# EAGLE schematic PIR Shield (EAGLE 6.4)
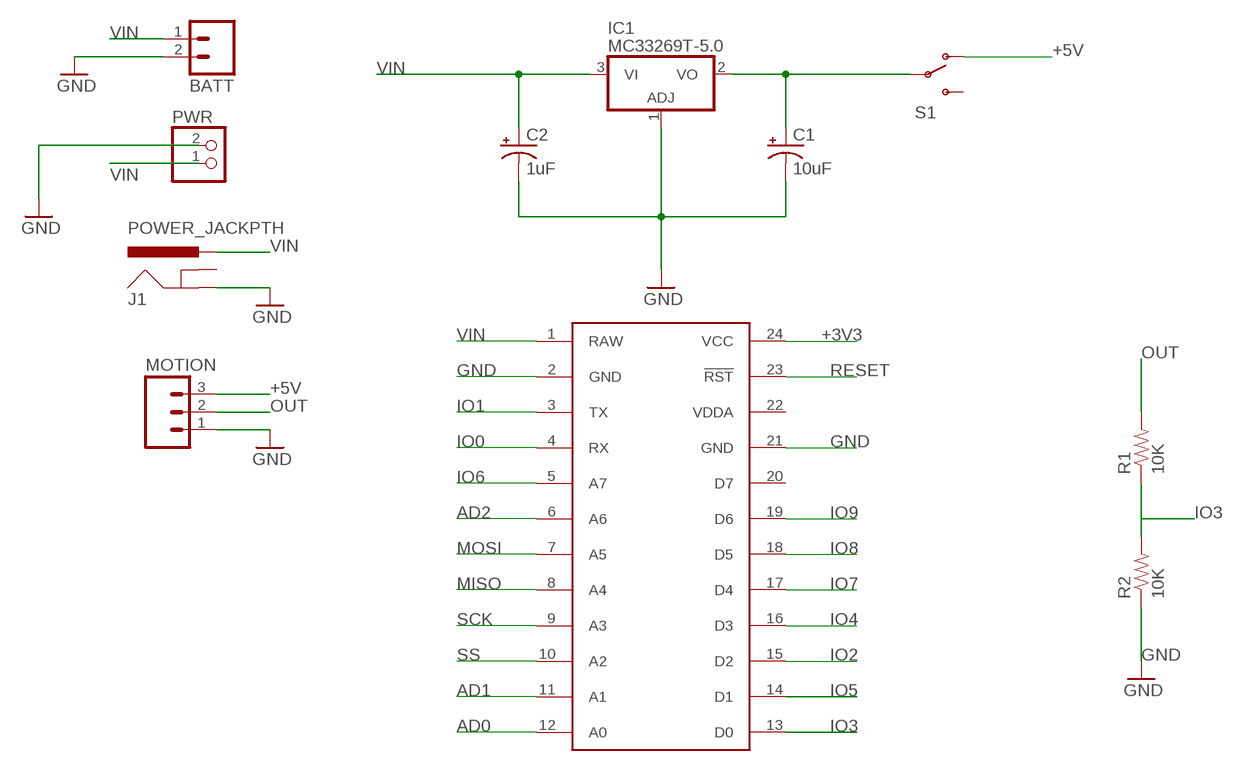
[diagram p0: schematic, sheet 1]

## Parts
BATT  M02LOCK  [1X02_LOCK]
C1  10uF  CAP_POLPTH2  [CPOL-RADIAL-10UF-25V]
C2  1uF  CAP_POLPTH2  [CPOL-RADIAL-10UF-25V]
IC1  MC33269T-5.0  [TO220V]
J1  POWER_JACKPTH  [POWER_JACK_PTH]
MOTION  M03PTH  [1X03]
PWR  JST_2PIN-THM  [JST-PH-2-THM]
R1  10K  RESISTOREZ  [AXIAL-0.3EZ]
R2  10K  RESISTOREZ  [AXIAL-0.3EZ]
S1  SWITCH-SPDTPTH  [SWITCH-SPDT]
U$1  SPARK_CORECORE  [SPARK_CORE]

## Nets
+3V3: U$1.24(VCC)
+5V: MOTION.3 S1.1(O)
AD0: U$1.12(A0)
AD1: U$1.11(A1)
AD2: U$1.6(A6)
GND: BATT.2 C1.2(-) C2.2(-) IC1.1(ADJ) J1.GND MOTION.1 PWR.2 R2.P$1 U$1.2(GND) U$1.21(GND)
IO0: U$1.4(RX)
IO1: U$1.3(TX)
IO2: U$1.15(D2)
IO3: R1.P$1 R2.P$2 U$1.13(D0)
IO4: U$1.16(D3)
IO5: U$1.14(D1)
IO6: U$1.5(A7)
IO7: U$1.17(D4)
IO8: U$1.18(D5)
IO9: U$1.19(D6)
MISO: U$1.8(A4)
MOSI: U$1.7(A5)
N1: C1.1(+) IC1.2(VO) S1.2(P)
OUT: MOTION.2 R1.P$2
RESET: U$1.23(!RST)
SCK: U$1.9(A3)
SS: U$1.10(A2)
VIN: BATT.1 C2.1(+) IC1.3(VI) J1.PWR PWR.1 U$1.1(RAW)
Unconnected: J1.GNDBREAK S1.3(S) U$1.20(D7)

## Power pins joined to a net without a drawn wire
VDDA: U$1.22(VDDA)

## Library data of the parts
BATT = SparkFun-Connectors:M02: Header 2 Standard 2-pin 0.1" header. Use with straight break away headers (SKU : PRT-00116), right angle break away headers (PRT-00553), swiss pins (PRT-00743), machine pins (PRT-00117), and female headers (PRT-00115). Molex polarized connector foot print use with SKU : PRT-08233 with associated crimp pins and housings.
C1 C2 = SparkFun-Capacitors:CAP_POL: Capacitor Polarized These are standard SMD and PTH capacitors. Normally 10uF, 47uF, and 100uF in electrolytic and tantalum varieties. Always verify the external diameter of the through hole cap, it varies with capacity, voltage, and manufacturer. The EIA devices should be standard.
IC1 = linear:MC33269?*: Adjustable Output Low Dropout Voltage Regulator 800 mA Source: http://www.onsemi.com/pub/Collateral/MC33269-D.PDF
J1 = SparkFun-Connectors:POWER_JACK: Power Jack This is the standard 5.5mm barrel jack for power. The PTH is the most common, proven, reliable, footprint. The Slot footprint only works if the mill layer is transmitted to the PCB fab house so be warned. Spark Fun Electronics SKU : PRT-00119 SMT: CONN-08106 Mating wall wart : TOL-00298 (and others)
MOTION = SparkFun-Connectors:M03: Header 3 Standard 3-pin 0.1" header. Use with straight break away headers (SKU : PRT-00116), right angle break away headers (PRT-00553), swiss pins (PRT-00743), machine pins (PRT-00117), and female headers (PRT-00115). Molex polarized connector foot print use with SKU : PRT-08232 with associated crimp pins and housings.
PWR = adafruit:JST_2PIN: JST 2-Pin Connectors of various flavors SMT-RA (S2B-PH-SM4) 4UConnector #17311 SMT (B2B-PH-SM4) THM-RA (S2B-PH) THM (B2B-PH)
R1 R2 = SparkFun-Resistors:RESISTOR: Resistor Basic schematic elements and footprints for 0603, 1206, and PTH resistors.
S1 = SparkFun-Electromechanical:SWITCH-SPDT: SPDT Switch Simple slide switch, Spark Fun Electronics SKU : COM-00102 DPDT SMT slide switch, AYZ0202, SWCH-08179
U$1 = Spark:SPARK_CORE

## Net classes
0 default: width 0.152 mm, drill 0.305 mm, clearance 0.152 mm